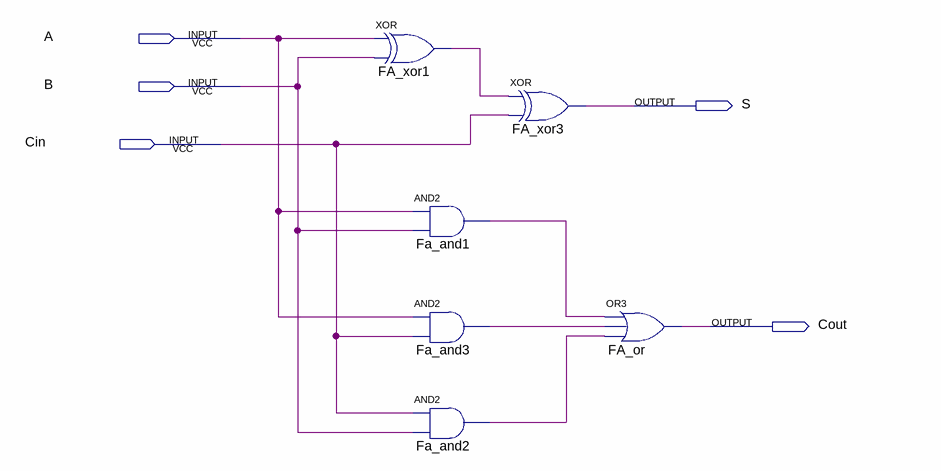
[diagram p0: schematic sheet]
// Quartus schematic FA_1bit.bdf as structural Verilog: 6 symbols, 5 pins
module FA_1bit (
  input  A,
  input  B,
  input  Cin,
  output S,
  output Cout
);

  wire Fa_and1_out, Fa_and2_out, Fa_and3_out, FA_xor1_out;

  xor FA_xor1 (FA_xor1_out, A, B);
  and Fa_and1 (Fa_and1_out, A, B);
  and Fa_and3 (Fa_and3_out, A, Cin);
  and Fa_and2 (Fa_and2_out, Cin, B);
  xor FA_xor3 (S, FA_xor1_out, Cin);
  or FA_or (Cout, Fa_and1_out, Fa_and3_out, Fa_and2_out);
endmodule
